# EAGLE schematic TiNRS-Space (EAGLE 7.7.0)

## Sheet 1 of 5: MCU and CODEC
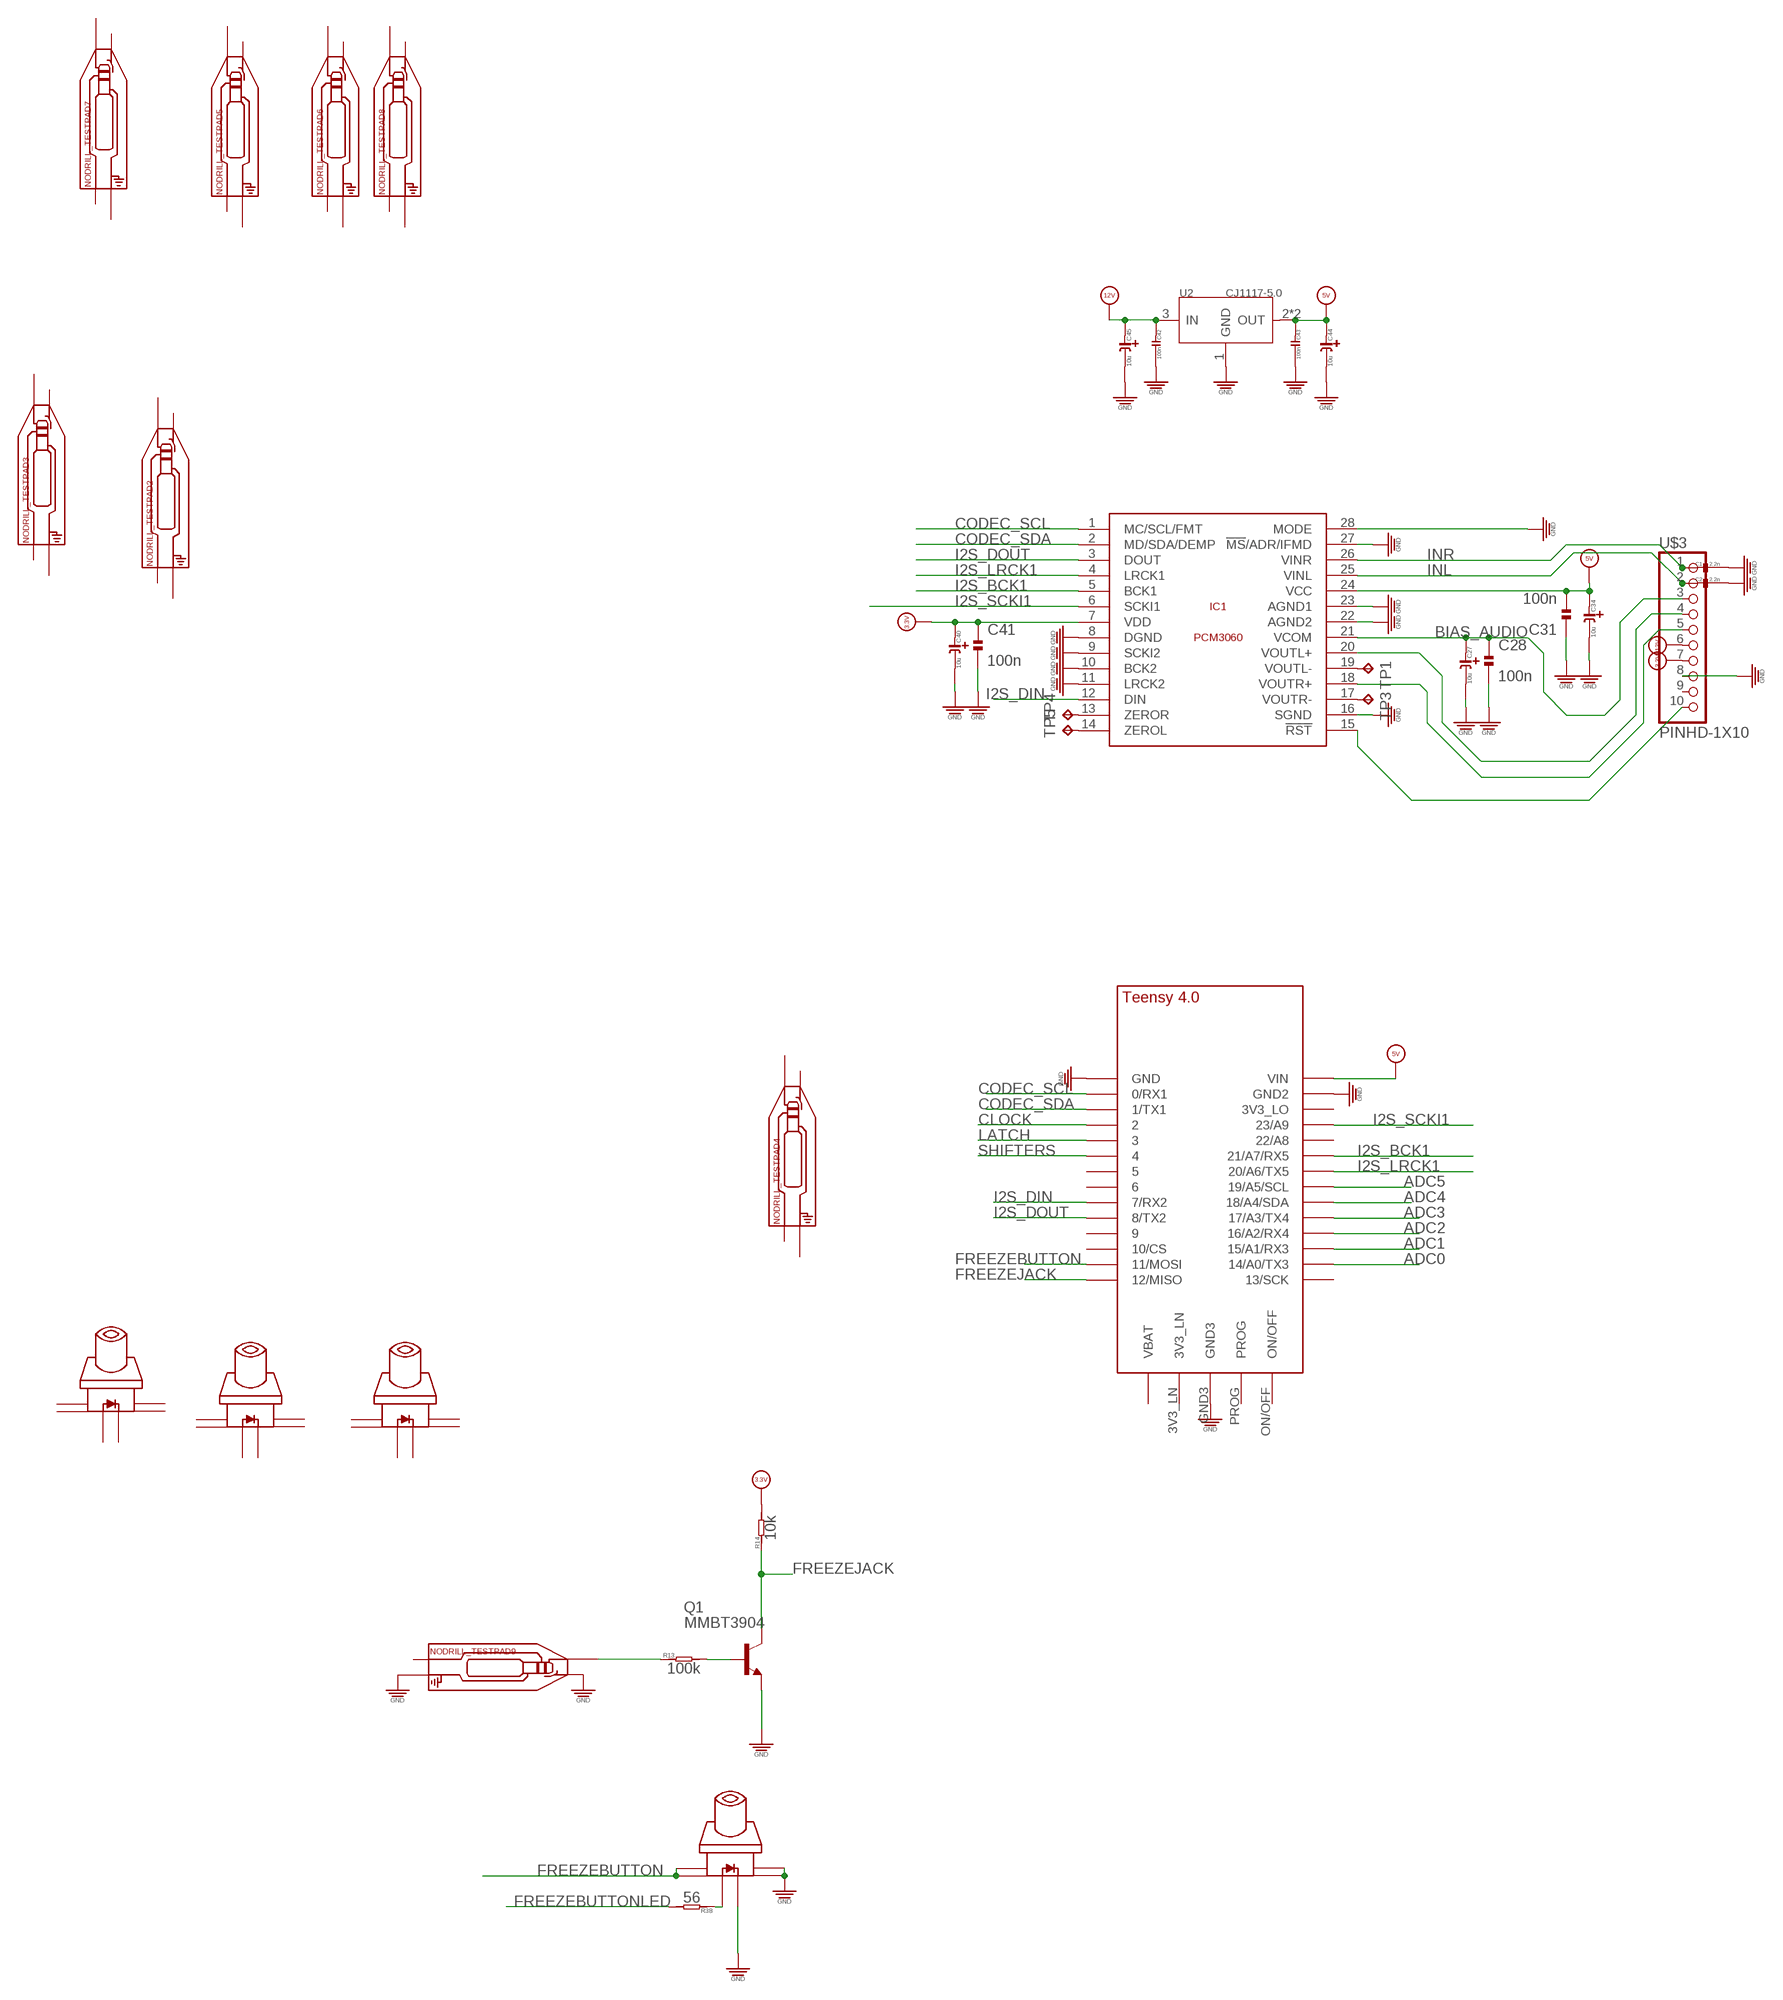
[diagram p0: schematic, sheet 1]

### Parts
C1  2.2n  C-0603  [C0603]
C2  2.2n  C-0603  [C0603]
C27  10u  C-POLAR-A  [CASE-A_3216]
C28  100n  C-EUC0402  [C0402]
C31  100n  C-EUC0402  [C0402]
C34  10u  C-POLAR-A  [CASE-A_3216]
C40  10u  C-POLAR-A  [CASE-A_3216]
C41  100n  C-EUC0402  [C0402]
C42  100n  C-0603  [C0603]
C43  100n  C-0603  [C0603]
C44  10u  C-POLAR-A  [CASE-A_3216]
C45  10u  C-POLAR-A  [CASE-A_3216]
IC1  PCM3060  [TSSOP-28]
NODRILL_TESTPAD2  AUDIO-JACK_SMALLSYMBOL  [3.5MM-JACK-SWITCH-13MM-NOHOLES-TESTPAD]
NODRILL_TESTPAD3  AUDIO-JACK_SMALLSYMBOL  [3.5MM-JACK-SWITCH-13MM-NOHOLES-TESTPAD]
NODRILL_TESTPAD4  AUDIO-JACK_SMALLSYMBOL  [3.5MM-JACK-SWITCH-13MM-NOHOLES-TESTPAD]
NODRILL_TESTPAD5  AUDIO-JACK_SMALLSYMBOL  [3.5MM-JACK-SWITCH-13MM-NOHOLES-TESTPAD]
NODRILL_TESTPAD6  AUDIO-JACK_SMALLSYMBOL  [3.5MM-JACK-SWITCH-13MM-NOHOLES-TESTPAD]
NODRILL_TESTPAD7  AUDIO-JACK_SMALLSYMBOL  [3.5MM-JACK-SWITCH-13MM-NOHOLES-TESTPAD]
NODRILL_TESTPAD8  AUDIO-JACK_SMALLSYMBOL  [3.5MM-JACK-SWITCH-13MM-NOHOLES-TESTPAD]
NODRILL_TESTPAD9  AUDIO-JACK_SMALLSYMBOL  [3.5MM-JACK-SWITCH-13MM-NOHOLES-TESTPAD]
Q1  MMBT3904  MMBT3904LT1-NPN-SOT23-BEC  [SOT23-BEC]
R13  100k  R-0603  [R0603]
R14  10k  R-0603  [R0603]
R38  56  R-0603  [R0603]
TP1  TPB2,54  [B2,54]
TP3  TPB2,54  [B2,54]
TP4  TPB2,54  [B2,54]
TP5  TPB2,54  [B2,54]
U2  CJ1117-5.0  CJ1117-3.3-1310190P1  [SOT223]
U$3  PINHD-1X10  [1X10-BIG]
U$5  TEENSY_4.0  [TEENSY_4.0]
U$9  SWITCH_W_LED_PB6149L-X-102YELLOW  [PB6149L]
U$27  SWITCH_W_LED_PB6149L-X-102YELLOW  [PB6149L]
U$28  SWITCH_W_LED_PB6149L-X-102YELLOW  [PB6149L]
U$31  SWITCH_W_LED_PB6149L-X-102YELLOW  [PB6149L]

### Nets
3.3V: C40.+ C41.1 IC1.7(VDD) R14.2 U$3.7 ; also sheet 2,3,4
5V [power]: C31.2 C34.+ C43.1 C44.+ IC1.24(VCC) U2.2(OUT) U2.TER(OUT) U$5.VIN
12V [power]: C42.1 C45.+ U2.3(IN) U$3.6 ; also sheet 4
ADC0: U$5.14/A0(14/A0/TX3) ; also sheet 2
ADC1: U$5.15/A1(15/A1/RX3) ; also sheet 2
ADC2: U$5.16/A2(16/A2/RX4) ; also sheet 2
ADC3: U$5.17/A3(17/A3/TX4) ; also sheet 2
ADC4: U$5.18/A4/SDA ; also sheet 2
ADC5: U$5.19/A5/SCL ; also sheet 2
BIAS_AUDIO: C27.+ C28.1 IC1.21(VCOM) U$3.3
CLOCK: U$5.2 ; also sheet 3
CODEC_SCL: IC1.1(MC/SCL/FMT) U$5.0/RX(0/RX1)
CODEC_SDA: IC1.2(MD/SDA/DEMP) U$5.1/TX(1/TX1)
FREEZEBUTTON: U$5.11/MOSI U$9.1 U$9.2
FREEZEBUTTONLED: R38.2 ; also sheet 3
FREEZEJACK: Q1.C R14.1 U$5.12/MISO
GND: C1.2 C2.2 C27.- C28.2 C31.1 C34.- C40.- C41.2 C42.2 C43.2 C44.- C45.- IC1.8(DGND) IC1.9(SCKI2) IC1.10(BCK2) IC1.11(LRCK2) IC1.16(SGND) IC1.22(AGND2) IC1.23(AGND1) IC1.27(!MS!/ADR/IFMD) IC1.28(MODE) NODRILL_TESTPAD9.RING_B@1(RING) NODRILL_TESTPAD9.RING_T@3(RING) NODRILL_TESTPAD9.SWITCH_B@1(SWITCH) NODRILL_TESTPAD9.SWITCH_T@3(SWITCH) Q1.E U2.1(GND) U$3.8 U$5.GND U$5.GND2 U$5.GND3 U$9.3 U$9.4 U$9.LEDNEG(NEG) ; also sheet 2,3,4
I2S_BCK1: IC1.5(BCK1) U$5.21/A7(21/A7/RX5)
I2S_DIN: IC1.12(DIN) U$5.7(7/RX2)
I2S_DOUT: IC1.3(DOUT) U$5.8(8/TX2)
I2S_LRCK1: IC1.4(LRCK1) U$5.20/A6(20/A6/TX5)
I2S_SCKI1: IC1.6(SCKI1) U$5.23/A9
INL: C2.1 IC1.25(VINL) U$3.2
INR: C1.1 IC1.26(VINR) U$3.1
LATCH: U$5.3/CANTX ; also sheet 3
N$1: IC1.20(VOUTL+) U$3.4
N$2: IC1.18(VOUTR+) U$3.5
N$3: IC1.19(VOUTL-) TP1.TP
N$4: IC1.15(!RST!) U$3.10
N$5: IC1.17(VOUTR-) TP3.TP
N$6: IC1.13(ZEROR) TP4.TP
N$7: IC1.14(ZEROL) TP5.TP
N$15: Q1.B R13.2
N$16: NODRILL_TESTPAD9.TIP_B@1(TIP) NODRILL_TESTPAD9.TIP_T@3(TIP) R13.1
N$41: R38.1 U$9.LEDPOS(POS)
SHIFTERS: U$5.4/CANRX ; also sheet 3
Unconnected: NODRILL_TESTPAD2.RING_B@1(RING) NODRILL_TESTPAD2.RING_T@3(RING) NODRILL_TESTPAD2.SECOND_B@1(SECOND) NODRILL_TESTPAD2.SECOND_T@3(SECOND) NODRILL_TESTPAD2.SWITCH_B@1(SWITCH) NODRILL_TESTPAD2.SWITCH_T@3(SWITCH) NODRILL_TESTPAD2.TIP_B@1(TIP) NODRILL_TESTPAD2.TIP_T@3(TIP) NODRILL_TESTPAD3.RING_B@1(RING) NODRILL_TESTPAD3.RING_T@3(RING) NODRILL_TESTPAD3.SECOND_B@1(SECOND) NODRILL_TESTPAD3.SECOND_T@3(SECOND) NODRILL_TESTPAD3.SWITCH_B@1(SWITCH) NODRILL_TESTPAD3.SWITCH_T@3(SWITCH) NODRILL_TESTPAD3.TIP_B@1(TIP) NODRILL_TESTPAD3.TIP_T@3(TIP) NODRILL_TESTPAD4.RING_B@1(RING) NODRILL_TESTPAD4.RING_T@3(RING) NODRILL_TESTPAD4.SECOND_B@1(SECOND) NODRILL_TESTPAD4.SECOND_T@3(SECOND) NODRILL_TESTPAD4.SWITCH_B@1(SWITCH) NODRILL_TESTPAD4.SWITCH_T@3(SWITCH) NODRILL_TESTPAD4.TIP_B@1(TIP) NODRILL_TESTPAD4.TIP_T@3(TIP) NODRILL_TESTPAD5.RING_B@1(RING) NODRILL_TESTPAD5.RING_T@3(RING) NODRILL_TESTPAD5.SECOND_B@1(SECOND) NODRILL_TESTPAD5.SECOND_T@3(SECOND) NODRILL_TESTPAD5.SWITCH_B@1(SWITCH) NODRILL_TESTPAD5.SWITCH_T@3(SWITCH) NODRILL_TESTPAD5.TIP_B@1(TIP) NODRILL_TESTPAD5.TIP_T@3(TIP) NODRILL_TESTPAD6.RING_B@1(RING) NODRILL_TESTPAD6.RING_T@3(RING) NODRILL_TESTPAD6.SECOND_B@1(SECOND) NODRILL_TESTPAD6.SECOND_T@3(SECOND) NODRILL_TESTPAD6.SWITCH_B@1(SWITCH) NODRILL_TESTPAD6.SWITCH_T@3(SWITCH) NODRILL_TESTPAD6.TIP_B@1(TIP) NODRILL_TESTPAD6.TIP_T@3(TIP) NODRILL_TESTPAD7.RING_B@1(RING) NODRILL_TESTPAD7.RING_T@3(RING) NODRILL_TESTPAD7.SECOND_B@1(SECOND) NODRILL_TESTPAD7.SECOND_T@3(SECOND) NODRILL_TESTPAD7.SWITCH_B@1(SWITCH) NODRILL_TESTPAD7.SWITCH_T@3(SWITCH) NODRILL_TESTPAD7.TIP_B@1(TIP) NODRILL_TESTPAD7.TIP_T@3(TIP) NODRILL_TESTPAD8.RING_B@1(RING) NODRILL_TESTPAD8.RING_T@3(RING) NODRILL_TESTPAD8.SECOND_B@1(SECOND) NODRILL_TESTPAD8.SECOND_T@3(SECOND) NODRILL_TESTPAD8.SWITCH_B@1(SWITCH) NODRILL_TESTPAD8.SWITCH_T@3(SWITCH) NODRILL_TESTPAD8.TIP_B@1(TIP) NODRILL_TESTPAD8.TIP_T@3(TIP) NODRILL_TESTPAD9.SECOND_B@1(SECOND) NODRILL_TESTPAD9.SECOND_T@3(SECOND) U$3.9 U$5.3V3_LN U$5.3V3_LO U$5.5 U$5.6 U$5.9/CS U$5.10/CS U$5.13/SCK U$5.22/A8 U$5.ON/OFF U$5.PROG U$5.VBAT\(VBAT) U$27.1 U$27.2 U$27.3 U$27.4 U$27.LEDNEG(NEG) U$27.LEDPOS(POS) U$28.1 U$28.2 U$28.3 U$28.4 U$28.LEDNEG(NEG) U$28.LEDPOS(POS) U$31.1 U$31.2 U$31.3 U$31.4 U$31.LEDNEG(NEG) U$31.LEDPOS(POS)

## Sheet 2 of 5: Pots and muxes
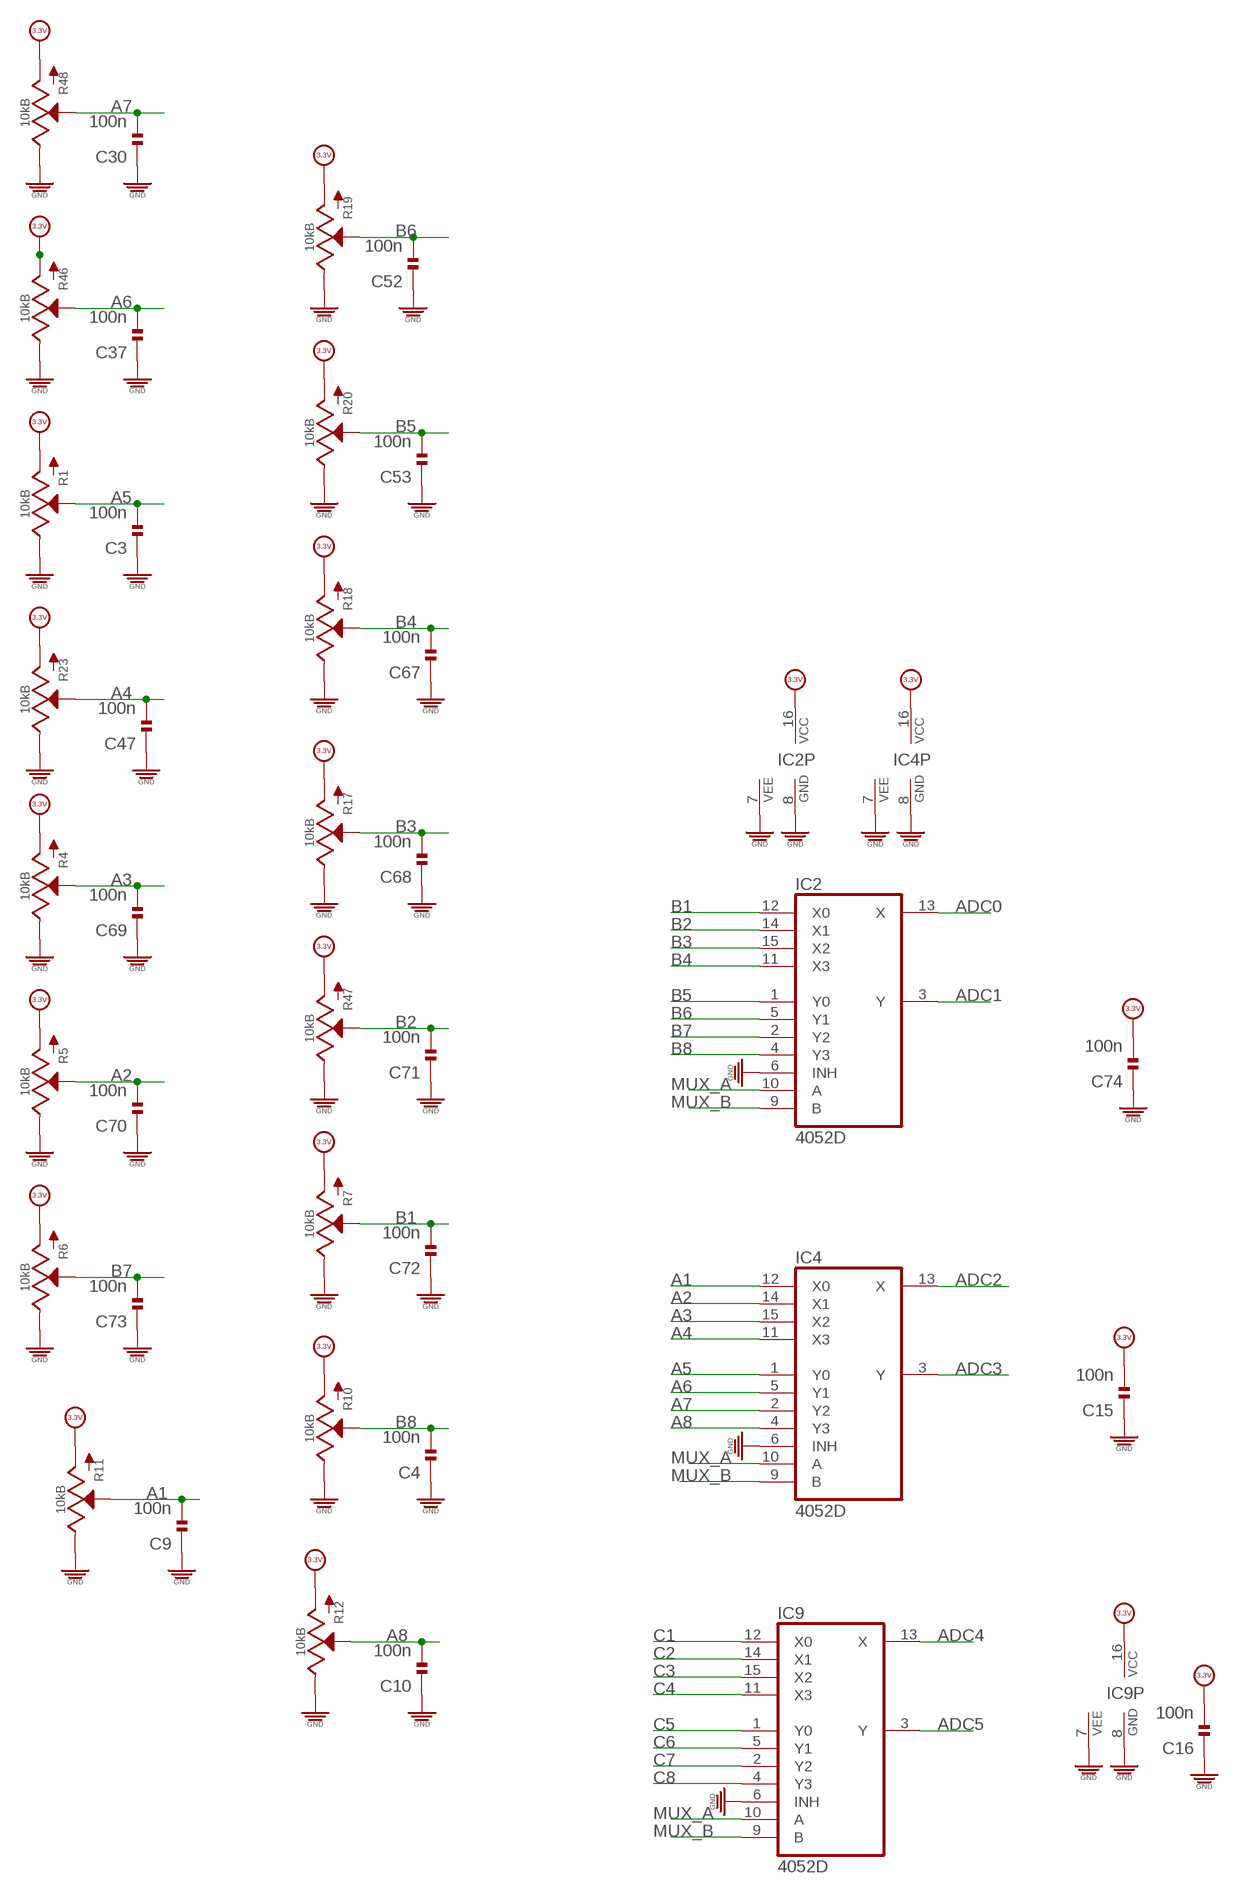
[diagram p1: schematic, sheet 2]

### Parts
C3  100n  C-EUC0402  [C0402]
C4  100n  C-EUC0402  [C0402]
C9  100n  C-EUC0402  [C0402]
C10  100n  C-EUC0402  [C0402]
C15  100n  C-EUC0402  [C0402]
C16  100n  C-EUC0402  [C0402]
C30  100n  C-EUC0402  [C0402]
C37  100n  C-EUC0402  [C0402]
C47  100n  C-EUC0402  [C0402]
C52  100n  C-EUC0402  [C0402]
C53  100n  C-EUC0402  [C0402]
C67  100n  C-EUC0402  [C0402]
C68  100n  C-EUC0402  [C0402]
C69  100n  C-EUC0402  [C0402]
C70  100n  C-EUC0402  [C0402]
C71  100n  C-EUC0402  [C0402]
C72  100n  C-EUC0402  [C0402]
C73  100n  C-EUC0402  [C0402]
C74  100n  C-EUC0402  [C0402]
IC2  4052D  [SO16]
IC4  4052D  [SO16]
IC9  4052D  [SO16]
R1  10kB  POTSQUAREHOLE_SMALLKNOB  [ALPS_POT_SQUAREHOLES]
R4  10kB  POTSQUAREHOLE_SMALLKNOB  [ALPS_POT_SQUAREHOLES]
R5  10kB  POTSQUAREHOLE_SMALLKNOB  [ALPS_POT_SQUAREHOLES]
R6  10kB  POTSQUAREHOLE_SMALLKNOB  [ALPS_POT_SQUAREHOLES]
R7  10kB  POTSQUAREHOLE_SMALLKNOB  [ALPS_POT_SQUAREHOLES]
R10  10kB  POTSQUAREHOLE_SMALLKNOB  [ALPS_POT_SQUAREHOLES]
R11  10kB  POTSQUAREHOLE_SMALLKNOB  [ALPS_POT_SQUAREHOLES]
R12  10kB  POTSQUAREHOLE_SMALLKNOB  [ALPS_POT_SQUAREHOLES]
R17  10kB  POTSQUAREHOLE_SMALLKNOB  [ALPS_POT_SQUAREHOLES]
R18  10kB  POTSQUAREHOLE_SMALLKNOB  [ALPS_POT_SQUAREHOLES]
R19  10kB  POTSQUAREHOLE_SMALLKNOB  [ALPS_POT_SQUAREHOLES]
R20  10kB  POTSQUAREHOLE_SMALLKNOB  [ALPS_POT_SQUAREHOLES]
R23  10kB  POTSQUAREHOLE_SMALLKNOB  [ALPS_POT_SQUAREHOLES]
R46  10kB  POTSQUAREHOLE_SMALLKNOB  [ALPS_POT_SQUAREHOLES]
R47  10kB  POTSQUAREHOLE_SMALLKNOB  [ALPS_POT_SQUAREHOLES]
R48  10kB  POTSQUAREHOLE_SMALLKNOB  [ALPS_POT_SQUAREHOLES]

### Nets
3.3V: C15.2 C16.2 C74.2 IC2.16(VCC) IC4.16(VCC) IC9.16(VCC) R1.P$3(A) R4.P$3(A) R5.P$3(A) R6.P$3(A) R7.P$3(A) R10.P$3(A) R11.P$3(A) R12.P$3(A) R17.P$3(A) R18.P$3(A) R19.P$3(A) R20.P$3(A) R23.P$3(A) R46.P$3(A) R47.P$3(A) R48.P$3(A) ; also sheet 1,3,4
A1: C9.2 IC4.12(X0) R11.P$2(S)
A2: C70.2 IC4.14(X1) R5.P$2(S)
A3: C69.2 IC4.15(X2) R4.P$2(S)
A4: C47.2 IC4.11(X3) R23.P$2(S)
A5: C3.2 IC4.1(Y0) R1.P$2(S)
A6: C37.2 IC4.5(Y1) R46.P$2(S)
A7: C30.2 IC4.2(Y2) R48.P$2(S)
A8: C10.2 IC4.4(Y3) R12.P$2(S)
ADC0: IC2.13(X) ; also sheet 1
ADC1: IC2.3(Y) ; also sheet 1
ADC2: IC4.13(X) ; also sheet 1
ADC3: IC4.3(Y) ; also sheet 1
ADC4: IC9.13(X) ; also sheet 1
ADC5: IC9.3(Y) ; also sheet 1
B1: C72.2 IC2.12(X0) R7.P$2(S)
B2: C71.2 IC2.14(X1) R47.P$2(S)
B3: C68.2 IC2.15(X2) R17.P$2(S)
B4: C67.2 IC2.11(X3) R18.P$2(S)
B5: C53.2 IC2.1(Y0) R20.P$2(S)
B6: C52.2 IC2.5(Y1) R19.P$2(S)
B7: C73.2 IC2.2(Y2) R6.P$2(S)
B8: C4.2 IC2.4(Y3) R10.P$2(S)
C1: IC9.12(X0)
C2: IC9.14(X1)
C3: IC9.15(X2)
C4: IC9.11(X3)
C5: IC9.1(Y0)
C6: IC9.5(Y1)
C7: IC9.2(Y2)
C8: IC9.4(Y3)
GND: C3.1 C4.1 C9.1 C10.1 C15.1 C16.1 C30.1 C37.1 C47.1 C52.1 C53.1 C67.1 C68.1 C69.1 C70.1 C71.1 C72.1 C73.1 C74.1 IC2.6(INH) IC2.7(VEE) IC2.8(GND) IC4.6(INH) IC4.7(VEE) IC4.8(GND) IC9.6(INH) IC9.7(VEE) IC9.8(GND) R1.P$1(E) R4.P$1(E) R5.P$1(E) R6.P$1(E) R7.P$1(E) R10.P$1(E) R11.P$1(E) R12.P$1(E) R17.P$1(E) R18.P$1(E) R19.P$1(E) R20.P$1(E) R23.P$1(E) R46.P$1(E) R47.P$1(E) R48.P$1(E) ; also sheet 1,3,4
MUX_A: IC2.10(A) IC4.10(A) IC9.10(A)
MUX_B: IC2.9(B) IC4.9(B) IC9.9(B)

## Sheet 3 of 5: LED shifters
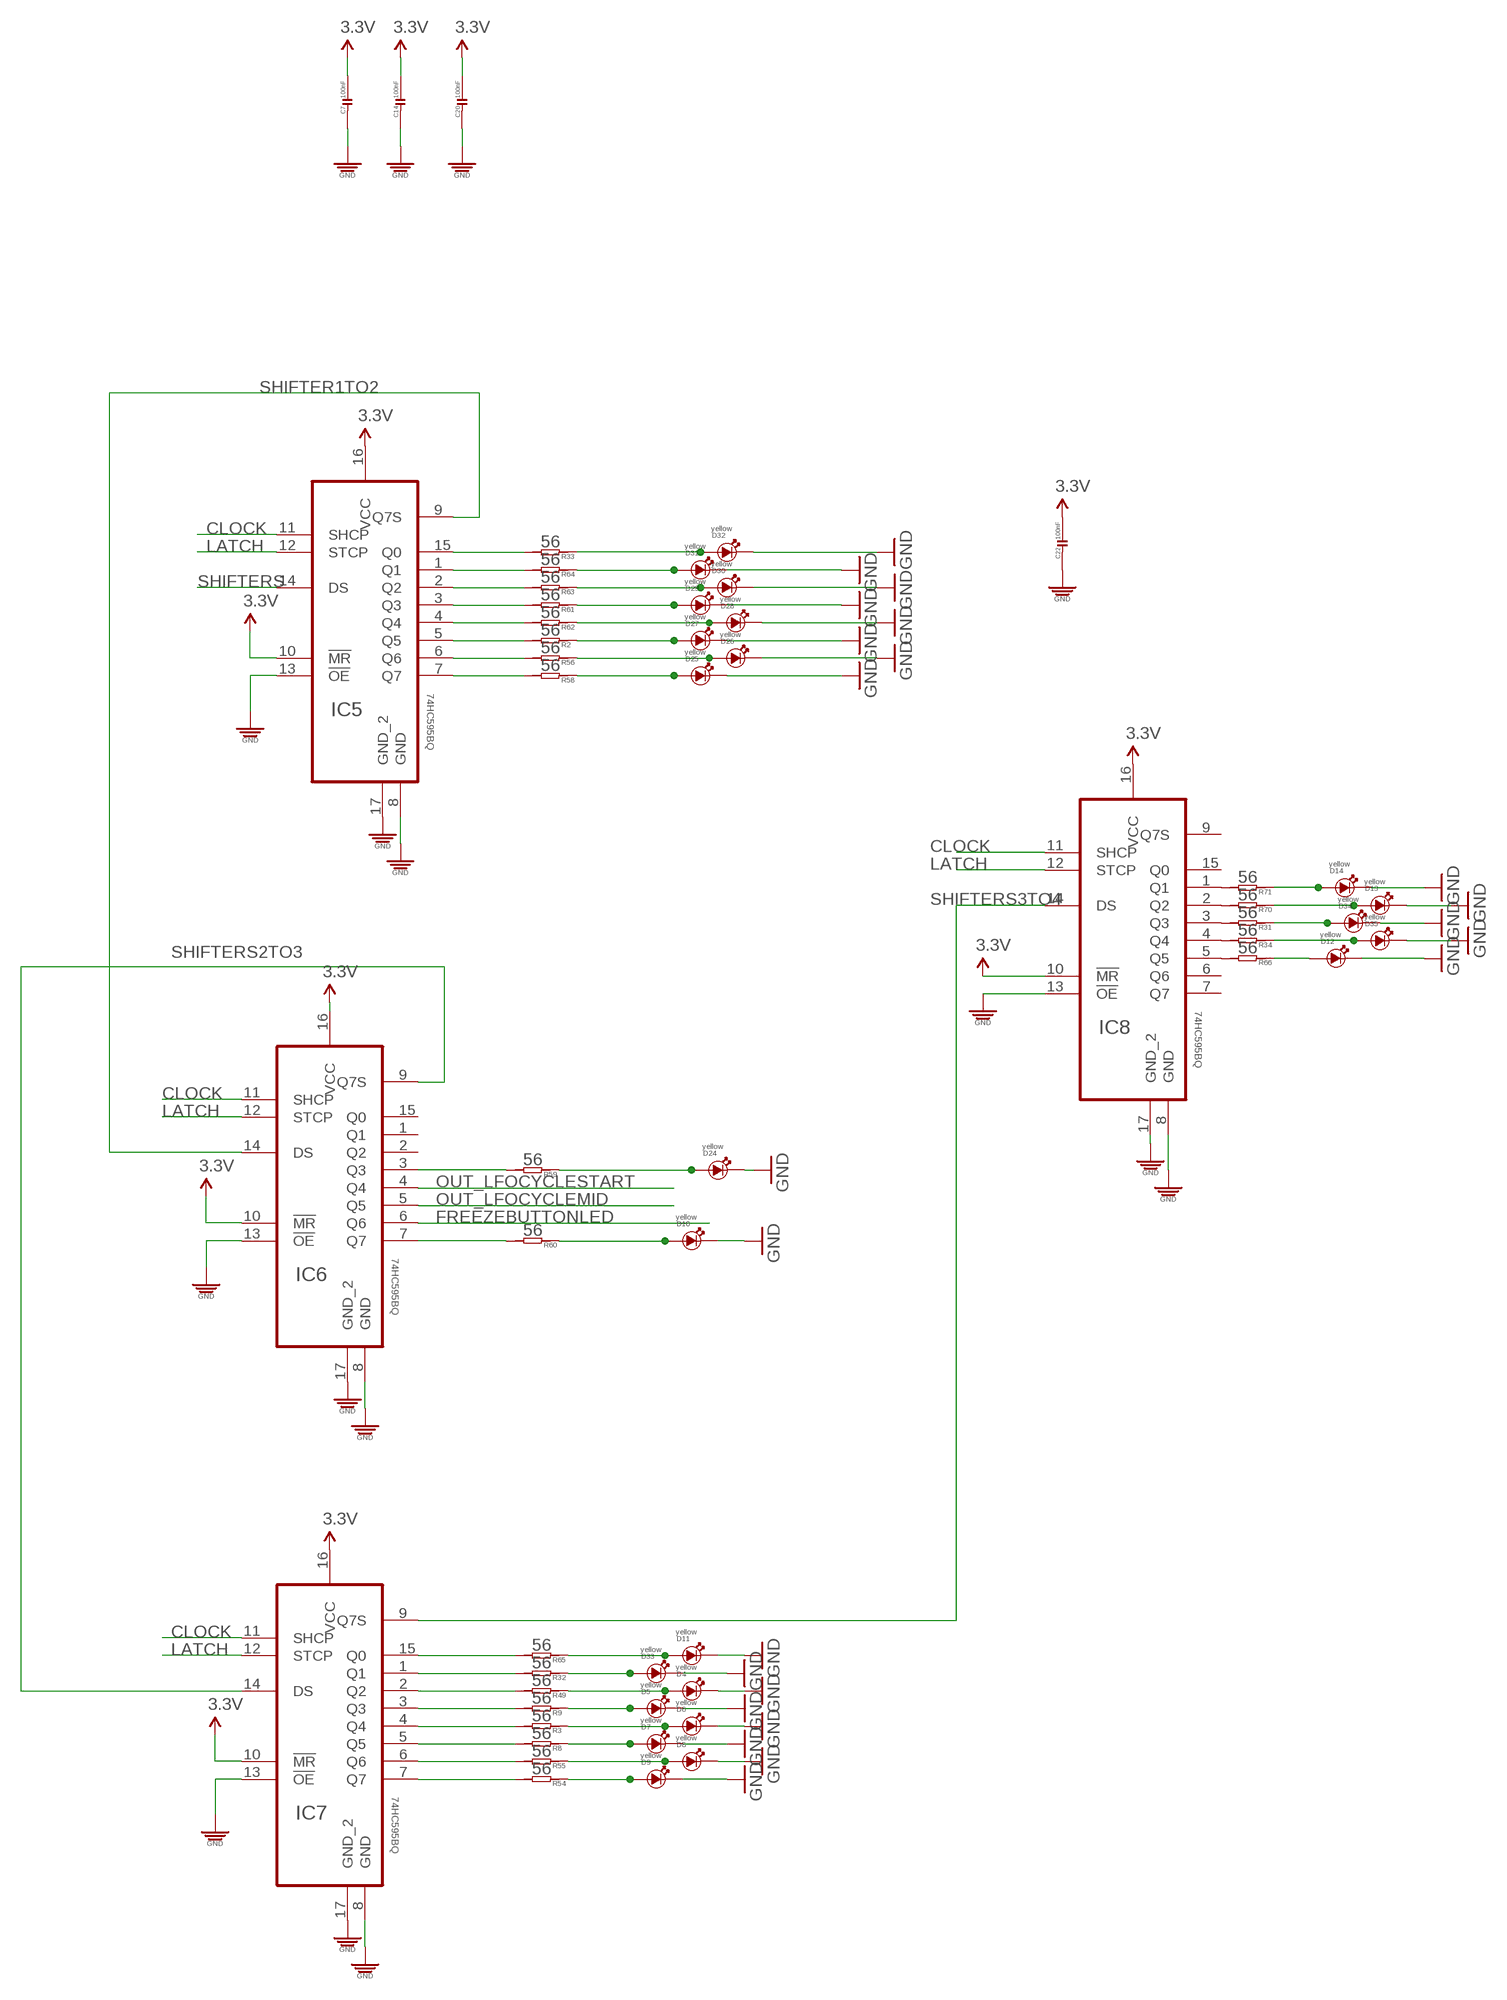
[diagram p2: schematic, sheet 3]

### Parts
C7  100nF  C-0603  [C0603]
C14  100nF  C-0603  [C0603]
C20  100nF  C-0603  [C0603]
C22  100nF  C-0603  [C0603]
D4  yellow  LED3MM  [3MMLED]
D5  yellow  LED3MM  [3MMLED]
D6  yellow  LED3MM  [3MMLED]
D7  yellow  LED3MM  [3MMLED]
D8  yellow  LED3MM  [3MMLED]
D9  yellow  LED3MM  [3MMLED]
D10  yellow  LED3MM  [3MMLED]
D11  yellow  LED3MM  [3MMLED]
D12  yellow  LED3MM  [3MMLED]
D13  yellow  LED3MM  [3MMLED]
D14  yellow  LED3MM  [3MMLED]
D24  yellow  LED3MM  [3MMLED]
D25  yellow  LED3MM  [3MMLED]
D26  yellow  LED3MM  [3MMLED]
D27  yellow  LED3MM  [3MMLED]
D28  yellow  LED3MM  [3MMLED]
D29  yellow  LED3MM  [3MMLED]
D30  yellow  LED3MM  [3MMLED]
D31  yellow  LED3MM  [3MMLED]
D32  yellow  LED3MM  [3MMLED]
D33  yellow  LED3MM  [3MMLED]
D34  yellow  LED3MM  [3MMLED]
D35  yellow  LED3MM  [3MMLED]
IC5  74HC595BQ  [QFN50P250X350X100-17N]
IC6  74HC595BQ  [QFN50P250X350X100-17N]
IC7  74HC595BQ  [QFN50P250X350X100-17N]
IC8  74HC595BQ  [QFN50P250X350X100-17N]
R2  56  R-0603  [R0603]
R3  56  R-0603  [R0603]
R8  56  R-0603  [R0603]
R9  56  R-0603  [R0603]
R31  56  R-0603  [R0603]
R32  56  R-0603  [R0603]
R33  56  R-0603  [R0603]
R34  56  R-0603  [R0603]
R49  56  R-0603  [R0603]
R54  56  R-0603  [R0603]
R55  56  R-0603  [R0603]
R56  56  R-0603  [R0603]
R58  56  R-0603  [R0603]
R59  56  R-0603  [R0603]
R60  56  R-0603  [R0603]
R61  56  R-0603  [R0603]
R62  56  R-0603  [R0603]
R63  56  R-0603  [R0603]
R64  56  R-0603  [R0603]
R65  56  R-0603  [R0603]
R66  56  R-0603  [R0603]
R70  56  R-0603  [R0603]
R71  56  R-0603  [R0603]

### Nets
3.3V: C7.2 C14.2 C20.2 C22.2 IC5.10(!MR) IC5.16(VCC) IC6.10(!MR) IC6.16(VCC) IC7.10(!MR) IC7.16(VCC) IC8.10(!MR) IC8.16(VCC) ; also sheet 1,2,4
CLOCK: IC5.11(SHCP) IC6.11(SHCP) IC7.11(SHCP) IC8.11(SHCP) ; also sheet 1
FREEZEBUTTONLED: IC6.6(Q6) ; also sheet 1
GND: C7.1 C14.1 C20.1 C22.1 D4.- D5.- D6.- D7.- D8.- D9.- D10.- D11.- D12.- D13.- D14.- D24.- D25.- D26.- D27.- D28.- D29.- D30.- D31.- D32.- D33.- D34.- D35.- IC5.8(GND) IC5.13(!OE) IC5.17(GND_2) IC6.8(GND) IC6.13(!OE) IC6.17(GND_2) IC7.8(GND) IC7.13(!OE) IC7.17(GND_2) IC8.8(GND) IC8.13(!OE) IC8.17(GND_2) ; also sheet 1,2,4
LATCH: IC5.12(STCP) IC6.12(STCP) IC7.12(STCP) IC8.12(STCP) ; also sheet 1
N$8: IC5.15(Q0) R33.2
N$14: D7.+ R8.1
N$19: IC5.1(Q1) R64.2
N$22: IC5.2(Q2) R63.2
N$26: IC5.3(Q3) R61.2
N$28: D28.+ R62.1
N$30: IC5.4(Q4) R62.2
N$31: IC5.5(Q5) R2.2
N$32: D29.+ R61.1
N$35: IC5.6(Q6) R56.2
N$36: IC5.7(Q7) R58.2
N$37: IC6.3(Q3) R59.2
N$38: IC7.7(Q7) R54.2
N$39: IC7.6(Q6) R55.2
N$40: IC7.5(Q5) R8.2
N$42: D13.+ R70.1
N$43: IC7.4(Q4) R3.2
N$46: D6.+ R3.1
N$47: D5.+ R9.1
N$48: D4.+ R49.1
N$49: D8.+ R55.1
N$50: D9.+ R54.1
N$51: D10.+ R60.1
N$52: D11.+ R65.1
N$53: IC7.3(Q3) R9.2
N$54: IC7.2(Q2) R49.2
N$55: IC7.1(Q1) R32.2
N$56: IC7.15(Q0) R65.2
N$57: IC6.7(Q7) R60.2
N$58: D14.+ R71.1
N$59: IC8.1(Q1) R71.2
N$62: IC8.2(Q2) R70.2
N$65: D12.+ R66.1
N$66: IC8.3(Q3) R31.2
N$67: IC8.4(Q4) R34.2
N$68: IC8.5(Q5) R66.2
N$73: D27.+ R2.1
N$74: D26.+ R56.1
N$75: D25.+ R58.1
N$76: D24.+ R59.1
N$77: D30.+ R63.1
N$78: D31.+ R64.1
N$79: D32.+ R33.1
N$80: D33.+ R32.1
N$81: D34.+ R31.1
N$82: D35.+ R34.1
OUT_LFOCYCLEMID: IC6.5(Q5)
OUT_LFOCYCLESTART: IC6.4(Q4)
SHIFTER1TO2: IC5.9(Q7S) IC6.14(DS)
SHIFTERS: IC5.14(DS) ; also sheet 1
SHIFTERS2TO3: IC6.9(Q7S) IC7.14(DS)
SHIFTERS3TO4: IC7.9(Q7S) IC8.14(DS)
Unconnected: IC6.1(Q1) IC6.2(Q2) IC6.15(Q0) IC8.6(Q6) IC8.7(Q7) IC8.9(Q7S) IC8.15(Q0)

## Sheet 4 of 5: Power
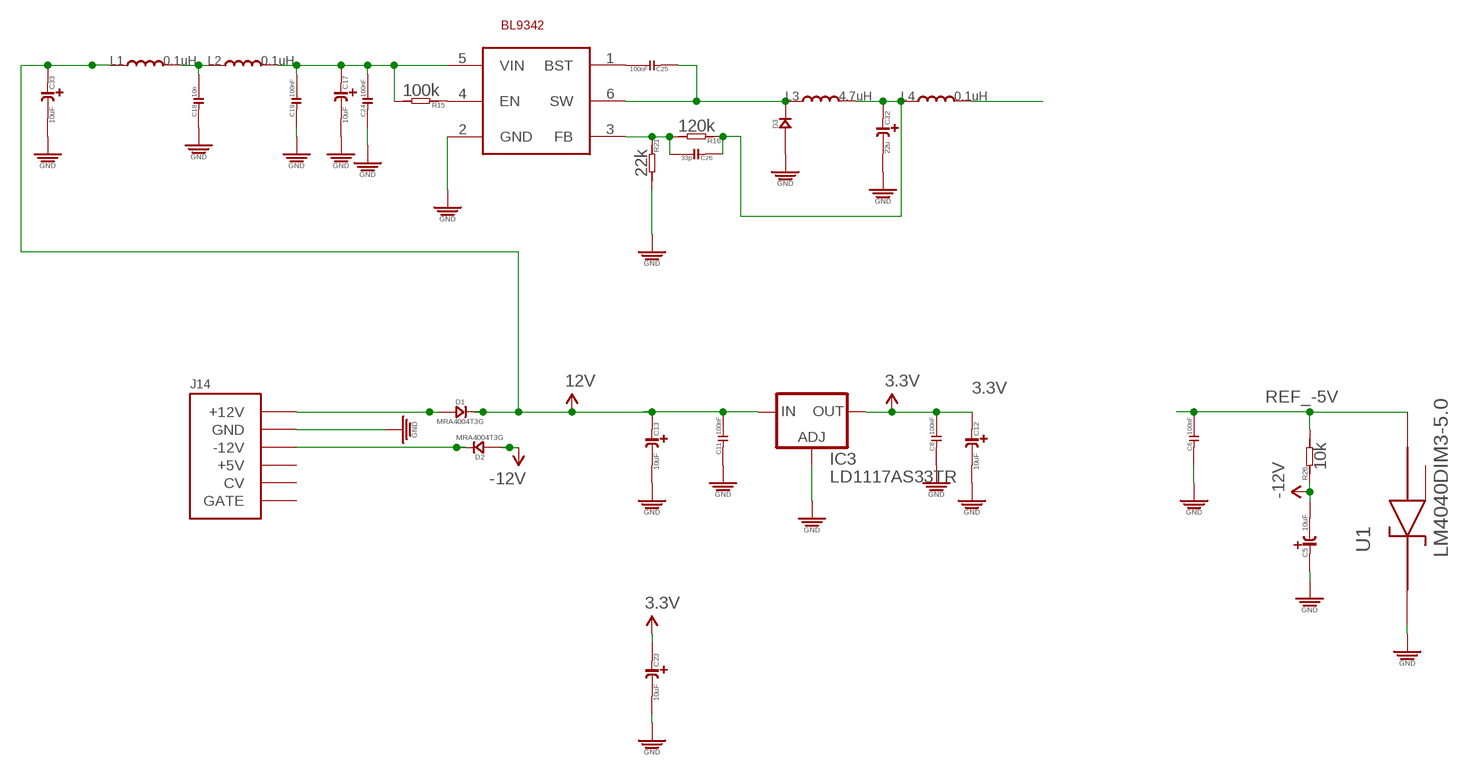
[diagram p3: schematic, sheet 4]

### Parts
C5  10uF  C-POLAR-A  [CASE-A_3216]
C6  100nF  C-0603  [C0603]
C8  100nF  C-0603  [C0603]
C11  100nF  C-0603  [C0603]
C12  10uF  C-POLAR-A  [CASE-A_3216]
C13  10uF  C-POLAR-A  [CASE-A_3216]
C17  10uF  C-POLAR-A  [CASE-A_3216]
C18  10n  C-0603  [C0603]
C19  100nF  C-0603  [C0603]
C23  10uF  C-POLAR-A  [CASE-A_3216]
C24  100nF  C-0603  [C0603]
C25  100nF  C-0603  [C0603]
C26  33p  C-0603  [C0603]
C32  22u  C-POLAR-A  [CASE-A_3216]
C33  10uF  C-POLAR-A  [CASE-A_3216]
D1  MRA4004T3G  D-SMA  [DO-214AC]
D2  MRA4004T3G  D-SMA  [DO-214AC]
D3  D-SMA  [DO-214AC]
IC3  LD1117AS33TR  [SOT223]
J14  POWERSHROUDED  [POWER_16_SHROUDED]
L1  0.1uH  L-0805  [L0805]
L2  0.1uH  L-0805  [L0805]
L3  4.7uH  L-SPD3D16-4R7M  [L0420]
L4  0.1uH  L-0805  [L0805]
R15  100k  R-0603  [R0603]
R16  120k  R-0603  [R0603]
R21  22k  R-0603  [R0603]
R26  10k  R-0603  [R0603]
U1  LM4040DIM3-5.0  [SOT95P237X112-3N]
U$29  BL9342  [SOT23-6]

### Nets
3.3V: C8.2 C12.+ C23.+ IC3.2(OUT) IC3.4(OUT) ; also sheet 1,2,3
5V_NEWREG: L4.2
12V [power]: C11.2 C13.+ C33.+ D1.2(-) IC3.3(IN) L1.1 ; also sheet 1
-12V [power]: C5.- D2.1(+) R26.1
GND: C5.+ C6.1 C8.1 C11.1 C12.- C13.- C17.- C18.1 C19.1 C23.- C24.1 C32.- C33.- D3.1(+) IC3.1(ADJ) J14.3(GND) J14.4(GND) J14.5(GND) J14.6(GND) J14.7(GND) J14.8(GND) R21.2 U1.1(CATHODE) U$29.2(GND) ; also sheet 1,2,3
N$9: C18.2 L1.2 L2.1
N$10: C17.+ C19.2 C24.2 L2.2 R15.2 U$29.5(VIN)
N$11: R15.1 U$29.4(EN)
N$12: C25.2 U$29.1(BST)
N$13 [power]: D1.1(+) J14.9(+12V) J14.10(+12V)
N$17: C25.1 D3.2(-) L3.1 U$29.6(SW)
N$20: C26.2 R16.2 R21.1 U$29.3(FB)
N$23: C26.1 C32.+ L3.2 L4.1 R16.1
N$64 [power]: D2.2(-) J14.1(-12V) J14.2(-12V)
REF_-5V: C6.2 R26.2 U1.2(ANODE)
Unconnected: J14.11(+5V) J14.12(+5V) J14.13(CV) J14.14(CV) J14.15(GATE) J14.16(GATE) U1.3(NC)

## Sheet 5 of 5: Cosmetic
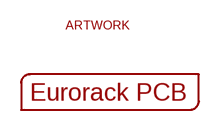
[diagram p4: schematic, sheet 5]

### Parts
PCB1  EURORACK_PCB24HP  [EURORACK24HPPCB]
U$4  TINRS_ARTWORKLOGO  [TINRSLOGO]

## Library data of the parts
C1 C2 C42 C43 = OPL:C*
C3 C4 C9 C10 C15 C16 C28 C30 C31 C37 C41 C47 C52 C53 C67-C74 = resistor:C-EU: CAPACITOR, European symbol
C5 C12 C13 C17 C23 C32 C33 = EurorackModularParts:C-POLAR*; MF: AVX; MPN: TAJB106K020RNJ; OC_FARNELL: 197427
C6 = OPL:C*; MF: AVX; MPN: 06035C104KAT2A; OC_FARNELL: 1301804
C7 C8 C11 C14 C18-C20 C22 C24-C26 = OPL:C*; MF: MULTICOMP; MPN: MC0603F104Z160CT; OC_FARNELL: 1759017
C27 C34 C40 C44 C45 = EurorackModularParts:C-POLAR*
D1 D2 = OPL:D*: DIODE; MF: VISHAY; MPN: US1G-E3/5AT; OC_FARNELL: 9551824
D3 = OPL:D*: DIODE
D4-D14 D24-D35 = EurorackModularParts:LED*: LED
IC1 = FenixBase:PCM3060
IC2 IC4 IC9 = 40xx:4052: Dual 4-channel ANALOG MULTIPLEXER
IC3 = ld-components:LD1117A?*: Low drop fixed and adjustable positive voltage regulators 1 A Source: http://www.st.com/stonline/products/literature/ds/7194/ld1117axx.pdf; MF: STMICROELECTRONICS; MPN: LD1117AS33TR; OC_FARNELL: 1467776
IC5-IC8 = FarnellThings:74HC595BQ: 8-bit serial-in, serial or parallel-out shift register,QFN-16; MF: NXP; MPN: 74HC595BQ; OC_FARNELL: 2164850; OC_NEWARK: 43W8000; PACKAGE: QFN-16; SUPPLIER: NXP
J14 = EurorackModularParts:POWER; OC_FARNELL: unknown
L1-L4 = OPL:L*
NODRILL_TESTPAD2-NODRILL_TESTPAD4 NODRILL_TESTPAD6-NODRILL_TESTPAD8 = EurorackModularParts:AUDIO-JACK_SMALLSYMBOL: Switching Mono 3.5mm Audio Jack from Erthenvar.
NODRILL_TESTPAD5 = EurorackModularParts:AUDIO-JACK_SMALLSYMBOL: Switching Mono 3.5mm Audio Jack from Erthenvar.; DESC: Out1
NODRILL_TESTPAD9 = EurorackModularParts:AUDIO-JACK_SMALLSYMBOL: Switching Mono 3.5mm Audio Jack from Erthenvar.; DESC: Freeze
PCB1 = EurorackModularParts:EURORACK_PCB
Q1 = transistor:*-NPN-: NPN Transistror BF959 corrected 2008.03.06; MF: NXP; MPN: PMBT3904,215; OC_FARNELL: 2336795
R1 = EurorackModularParts:POT; DESC: Predelay
R2 R3 R8 R9 R13-R16 R21 R26 R31-R34 R38 R49 R54-R56 R58-R66 R70 R71 = OPL:R*; OC_FARNELL: unknown
R4 = EurorackModularParts:POT; DESC: ER
R5 = EurorackModularParts:POT; DESC: Low
R6 = EurorackModularParts:POT; DESC: Temperature
R7 = EurorackModularParts:POT; DESC: Crossover
R10 = EurorackModularParts:POT; DESC: Mix
R11 = EurorackModularParts:POT; DESC: Amount
R12 = EurorackModularParts:POT; DESC: Speed
R17 = EurorackModularParts:POT; DESC: ModAmount
R18 = EurorackModularParts:POT; DESC: ShimmerAmount
R19 = EurorackModularParts:POT; DESC: Level
R20 = EurorackModularParts:POT; DESC: FolloerDecay
R23 = EurorackModularParts:POT; DESC: Diffuse
R46 = EurorackModularParts:POT; DESC: High
R47 = EurorackModularParts:POT; DESC: ShimmerPitch
R48 = EurorackModularParts:POT; DESC: Size
TP1 TP3-TP5 = testpad:TP: Test pad
U1 = FarnellThings:LM4040DIM3-5.0: IC, Precision Micropower Shunt Voltage Reference, 5V,SOT-23-3; MF: TEXAS INSTRUMENTS; MPN: LM4040DIM3-5.0; OC_FARNELL: 9778330; OC_NEWARK: 97K3489; PACKAGE: SOT-23-3; SUPPLIER: TEXAS INSTRUMENTS
U2 = OPL:CJ1117-3.3: 1A Low Dropout Linear Regulator
U$3 = adafruit:PINHD-1X10: Pin header 1x10 0.1" spacing With round pins
U$4 = EurorackModularParts:TINRS_ARTWORK
U$5 = EurorackModularParts:TEENSY_4.0
U$9 = zephod-components:SWITCH_W_LED_PB6149L-X-102
U$27 = zephod-components:SWITCH_W_LED_PB6149L-X-102; DESC: Style
U$28 = zephod-components:SWITCH_W_LED_PB6149L-X-102; DESC: Target
U$29 = EurorackModularParts:BL9342
U$31 = zephod-components:SWITCH_W_LED_PB6149L-X-102; DESC: MixSend

## Net classes
0 default: width 0.229 mm
1 power: width 0.508 mm
3 groundplane: width 0.203 mm, clearance 0.203 mm